# Altium project MEMS_Instrumentation.PrjPCB
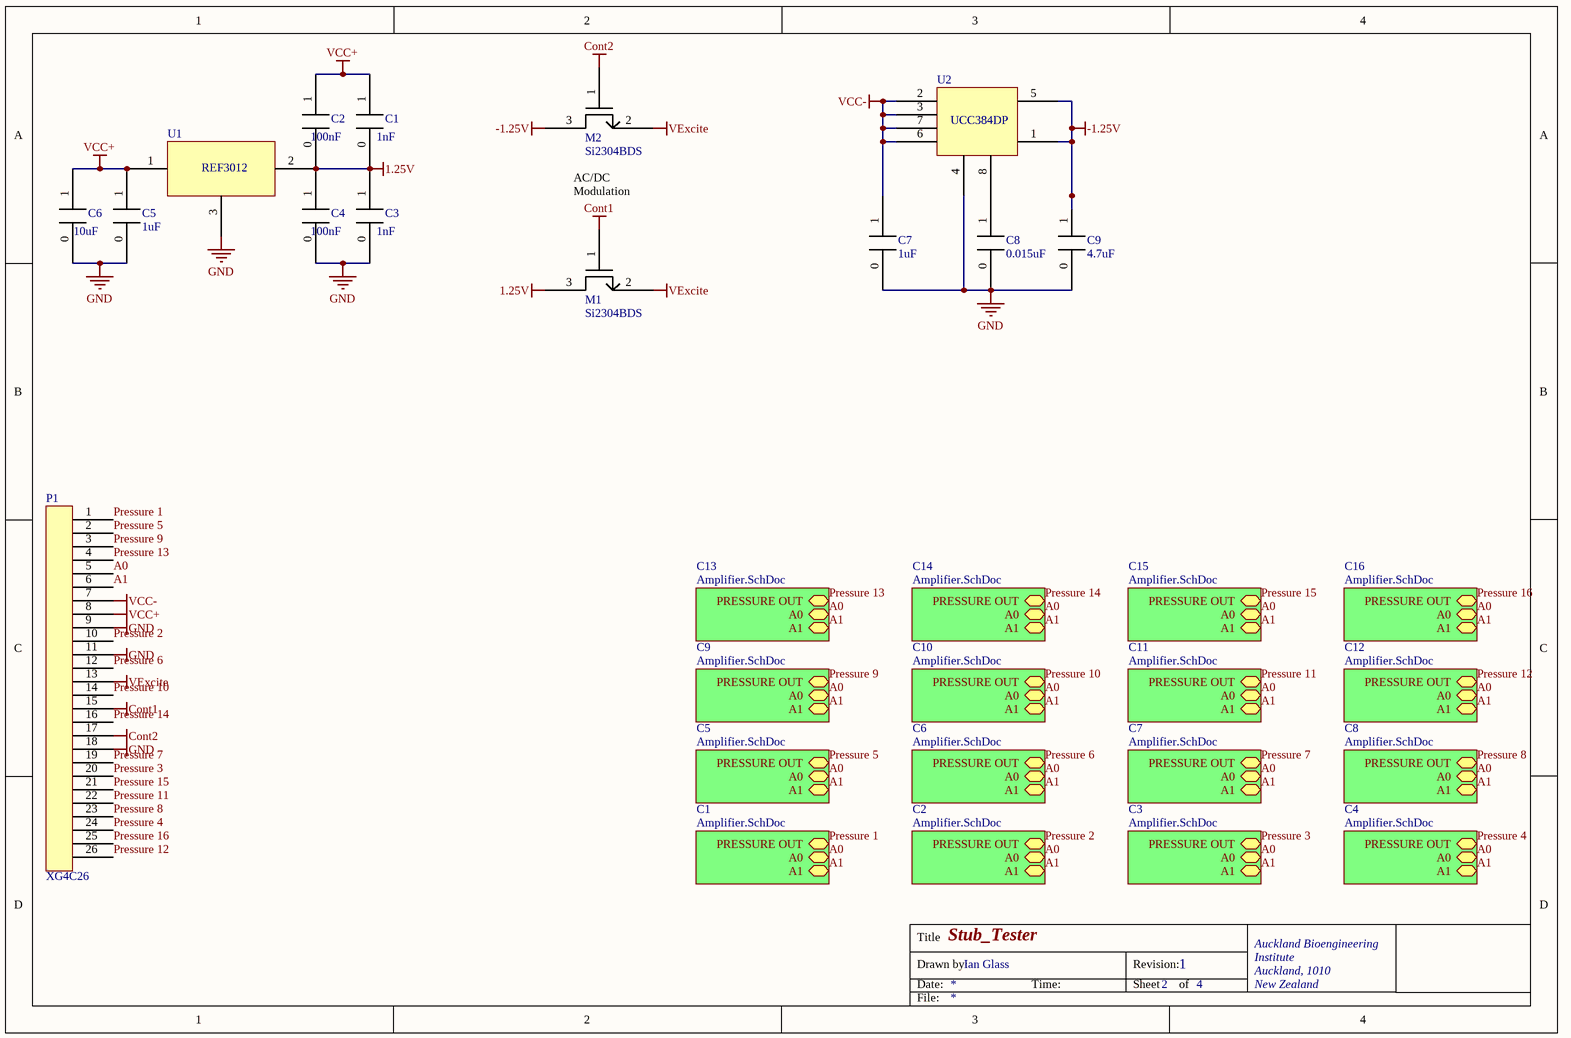
[diagram p0: Stub_Tester.SchDoc]
2 sheets, 110 parts. Net scope: hierarchical (ports join the sheet entries above them; power ports are global).
Board file: MEMS_Instrumentation.PcbDoc
Sheets:
  Stub_Tester.SchDoc
    C1 = Amplifier.SchDoc
    C2 = Amplifier.SchDoc
    C3 = Amplifier.SchDoc
    C4 = Amplifier.SchDoc
    C5 = Amplifier.SchDoc
    C6 = Amplifier.SchDoc
    C7 = Amplifier.SchDoc
    C8 = Amplifier.SchDoc
    C9 = Amplifier.SchDoc
    C10 = Amplifier.SchDoc
    C11 = Amplifier.SchDoc
    C12 = Amplifier.SchDoc
    C13 = Amplifier.SchDoc
    C14 = Amplifier.SchDoc
    C15 = Amplifier.SchDoc
    C16 = Amplifier.SchDoc

## Sheet Stub_Tester.SchDoc: Stub_Tester
size A4; DrawnBy: Ian Glass; Address1: Auckland Bioengineering; Address2: Institute; Address3: Auckland, 1010; Address4: New Zealand; Revision: 1; SheetNumber: 2; SheetTotal: 4

### Parts
C1  1nF  [C0603 1uF]
C2  100nF  [C0603 1uF]
C3  1nF  [C0603 1uF]
C4  100nF  [C0603 1uF]
C5  1uF  [C0603 1uF]
C6  10uF  [C0603 1uF]
C7  1uF  [C0603 1uF]
C8  0.015uF  [C0603 1uF]
C9  4.7uF  [C0603 1uF]
M1  Si2304BDS  [Si2304BDS]
M2  Si2304BDS  [Si2304BDS]
P1  XG4C26  [XG4C26]
U1  REF3012  [REF3012]  (value not drawn)
U2  UCC384DP  [UCC384DP]  (value not drawn)

### Sub-sheets
C1 = Amplifier.SchDoc: PRESSURE OUT, A0, A1
C2 = Amplifier.SchDoc: PRESSURE OUT, A0, A1
C3 = Amplifier.SchDoc: PRESSURE OUT, A0, A1
C4 = Amplifier.SchDoc: PRESSURE OUT, A0, A1
C5 = Amplifier.SchDoc: PRESSURE OUT, A0, A1
C6 = Amplifier.SchDoc: PRESSURE OUT, A0, A1
C7 = Amplifier.SchDoc: PRESSURE OUT, A0, A1
C8 = Amplifier.SchDoc: PRESSURE OUT, A0, A1
C9 = Amplifier.SchDoc: PRESSURE OUT, A0, A1
C10 = Amplifier.SchDoc: PRESSURE OUT, A0, A1
C11 = Amplifier.SchDoc: PRESSURE OUT, A0, A1
C12 = Amplifier.SchDoc: PRESSURE OUT, A0, A1
C13 = Amplifier.SchDoc: PRESSURE OUT, A0, A1
C14 = Amplifier.SchDoc: PRESSURE OUT, A0, A1
C15 = Amplifier.SchDoc: PRESSURE OUT, A0, A1
C16 = Amplifier.SchDoc: PRESSURE OUT, A0, A1

### Nets
1.25V: C1.0 C2.0 C3.1 C4.1 M1.3 U1.2
-1.25V: C9.1 M2.3 U2.1 U2.5
Cont1: M1.1 P1.15
Cont2: M2.1 P1.17
GND: C3.0 C4.0 C5.0 C6.0 C7.0 C8.0 C9.0 P1.9 P1.11 P1.18 U1.3 U2.4
VCC+: C1.1 C2.1 C5.1 C6.1 P1.8 U1.1
VCC-: C7.1 P1.7 U2.2 U2.3 U2.6 U2.7
VExcite: M1.2 M2.2 P1.13
A0: P1.5 ; sheet C1/A0, sheet C2/A0, sheet C3/A0, sheet C4/A0, sheet C5/A0, sheet C6/A0, sheet C7/A0, sheet C8/A0, sheet C9/A0, sheet C10/A0, sheet C11/A0, sheet C12/A0, sheet C13/A0, sheet C14/A0, sheet C15/A0, sheet C16/A0
A1: P1.6 ; sheet C1/A1, sheet C2/A1, sheet C3/A1, sheet C4/A1, sheet C5/A1, sheet C6/A1, sheet C7/A1, sheet C8/A1, sheet C9/A1, sheet C10/A1, sheet C11/A1, sheet C12/A1, sheet C13/A1, sheet C14/A1, sheet C15/A1, sheet C16/A1
Pressure 1: P1.1 ; sheet C1/PRESSURE OUT
Pressure 2: P1.10 ; sheet C2/PRESSURE OUT
Pressure 3: P1.20 ; sheet C3/PRESSURE OUT
Pressure 4: P1.24 ; sheet C4/PRESSURE OUT
Pressure 5: P1.2 ; sheet C5/PRESSURE OUT
Pressure 6: P1.12 ; sheet C6/PRESSURE OUT
Pressure 7: P1.19 ; sheet C7/PRESSURE OUT
Pressure 8: P1.23 ; sheet C8/PRESSURE OUT
Pressure 9: P1.3 ; sheet C9/PRESSURE OUT
Pressure 10: P1.14 ; sheet C10/PRESSURE OUT
Pressure 11: P1.22 ; sheet C11/PRESSURE OUT
Pressure 12: P1.26 ; sheet C12/PRESSURE OUT
Pressure 13: P1.4 ; sheet C13/PRESSURE OUT
Pressure 14: P1.16 ; sheet C14/PRESSURE OUT
Pressure 15: P1.21 ; sheet C15/PRESSURE OUT
Pressure 16: P1.25 ; sheet C16/PRESSURE OUT
NetC8_1: C8.1 U2.8

### Notes on the sheet
- (near M2) AC/DC Modulation
- Title
- Drawn by:
- Date:
- Time:
- Revision:
- Sheet
- of
- File:

### Library data of the parts
C1-C9 = C0603 1uF

## Sheet Amplifier.SchDoc: Amplifier
size A4; DrawnBy: Ian Glass; Address1: Auckland Bioengineering; Address2: Institute; Address3: Auckland, 1010; Address4: New Zealand; Revision: 1; SheetNumber: 4; SheetTotal: 4
Used 16 times, as channels C1, C2, C3, C4, C5, C6, C7, C8, C9, C10, C11, C12, C13, C14, C15, C16. Parts and nets are listed once, with the designators drawn on the sheet.
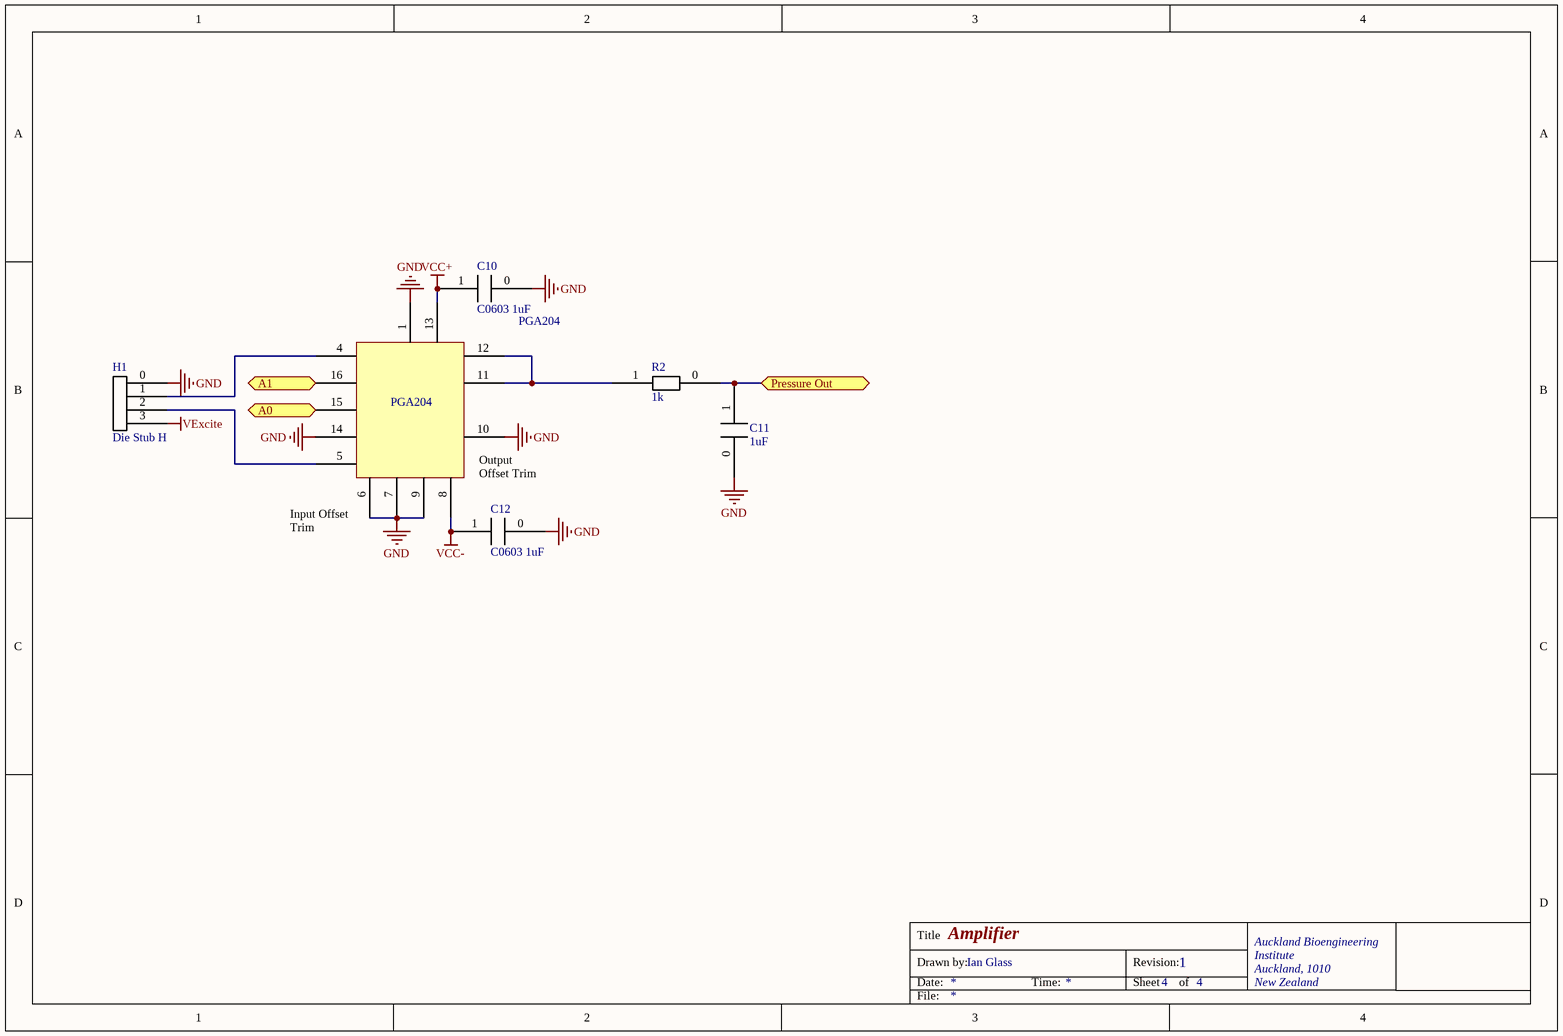
[diagram p1: Amplifier.SchDoc]

### Parts
C10  C0603 1uF  [C0603 1uF]
C11  1uF  [C0603 1uF]
C12  C0603 1uF  [C0603 1uF]
H1  Die Stub H  [Header1x4]
PGA204  PGA204  [PGA204]  (value not drawn)
R2  1k  [RT0603 330k]

### Ports
A0, A1, Pressure Out

### Nets
GND: C10.0 C11.0 C12.0 H1.0 PGA204.1 PGA204.6 PGA204.7 PGA204.9 PGA204.10 PGA204.14
VCC+: C10.1 PGA204.13
VCC-: C12.1 PGA204.8
VExcite: H1.3
A0: PGA204.15 ; port A0
A1: PGA204.16 ; port A1
Pressure Out: C11.1 R2.0 ; port Pressure Out
NetH1_1: H1.1 PGA204.4
NetH1_2: H1.2 PGA204.5
NetPGA204_11: PGA204.11 PGA204.12 R2.1

### Channels
C1: designators end in _C1; ports A0=A0 A1=A1 Pressure Out=Pressure 1
C2: designators end in _C2; ports A0=A0 A1=A1 Pressure Out=Pressure 2
C3: designators end in _C3; ports A0=A0 A1=A1 Pressure Out=Pressure 3
C4: designators end in _C4; ports A0=A0 A1=A1 Pressure Out=Pressure 4
C5: designators end in _C5; ports A0=A0 A1=A1 Pressure Out=Pressure 5
C6: designators end in _C6; ports A0=A0 A1=A1 Pressure Out=Pressure 6
C7: designators end in _C7; ports A0=A0 A1=A1 Pressure Out=Pressure 7
C8: designators end in _C8; ports A0=A0 A1=A1 Pressure Out=Pressure 8
C9: designators end in _C9; ports A0=A0 A1=A1 Pressure Out=Pressure 9
C10: designators end in _C10; ports A0=A0 A1=A1 Pressure Out=Pressure 10
C11: designators end in _C11; ports A0=A0 A1=A1 Pressure Out=Pressure 11
C12: designators end in _C12; ports A0=A0 A1=A1 Pressure Out=Pressure 12
C13: designators end in _C13; ports A0=A0 A1=A1 Pressure Out=Pressure 13
C14: designators end in _C14; ports A0=A0 A1=A1 Pressure Out=Pressure 14
C15: designators end in _C15; ports A0=A0 A1=A1 Pressure Out=Pressure 15
C16: designators end in _C16; ports A0=A0 A1=A1 Pressure Out=Pressure 16

### Notes on the sheet
- (near PGA204) Output Offset Trim
- (near PGA204) Input Offset Trim
- Title
- Drawn by:
- Date:
- Time:
- Revision:
- Sheet
- of
- File:

### Library data of the parts
C11 = C0603 1uF
H1 = Header1x4
R2 = RT0603 330k

## Nets that join several sheets
GND: Stub_Tester (12 pins), C1 (10 pins), C2 (10 pins), C3 (10 pins), C4 (10 pins), C5 (10 pins), C6 (10 pins), C7 (10 pins), C8 (10 pins), C9 (10 pins), C10 (10 pins), C11 (10 pins), C12 (10 pins), C13 (10 pins), C14 (10 pins), C15 (10 pins), C16 (10 pins)
VCC+: Stub_Tester (6 pins), C1 (C10_C1.1 PGA204_C1.13), C2 (C10_C2.1 PGA204_C2.13), C3 (C10_C3.1 PGA204_C3.13), C4 (C10_C4.1 PGA204_C4.13), C5 (C10_C5.1 PGA204_C5.13), C6 (C10_C6.1 PGA204_C6.13), C7 (C10_C7.1 PGA204_C7.13), C8 (C10_C8.1 PGA204_C8.13), C9 (C10_C9.1 PGA204_C9.13), C10 (C10_C10.1 PGA204_C10.13), C11 (C10_C11.1 PGA204_C11.13), C12 (C10_C12.1 PGA204_C12.13), C13 (C10_C13.1 PGA204_C13.13), C14 (C10_C14.1 PGA204_C14.13), C15 (C10_C15.1 PGA204_C15.13), C16 (C10_C16.1 PGA204_C16.13)
VCC-: Stub_Tester (6 pins), C1 (C12_C1.1 PGA204_C1.8), C2 (C12_C2.1 PGA204_C2.8), C3 (C12_C3.1 PGA204_C3.8), C4 (C12_C4.1 PGA204_C4.8), C5 (C12_C5.1 PGA204_C5.8), C6 (C12_C6.1 PGA204_C6.8), C7 (C12_C7.1 PGA204_C7.8), C8 (C12_C8.1 PGA204_C8.8), C9 (C12_C9.1 PGA204_C9.8), C10 (C12_C10.1 PGA204_C10.8), C11 (C12_C11.1 PGA204_C11.8), C12 (C12_C12.1 PGA204_C12.8), C13 (C12_C13.1 PGA204_C13.8), C14 (C12_C14.1 PGA204_C14.8), C15 (C12_C15.1 PGA204_C15.8), C16 (C12_C16.1 PGA204_C16.8)
VExcite: Stub_Tester (M1.2 M2.2 P1.13), C1 (H1_C1.3), C2 (H1_C2.3), C3 (H1_C3.3), C4 (H1_C4.3), C5 (H1_C5.3), C6 (H1_C6.3), C7 (H1_C7.3), C8 (H1_C8.3), C9 (H1_C9.3), C10 (H1_C10.3), C11 (H1_C11.3), C12 (H1_C12.3), C13 (H1_C13.3), C14 (H1_C14.3), C15 (H1_C15.3), C16 (H1_C16.3)
A0: Stub_Tester (P1.5), C1 (PGA204_C1.15), C2 (PGA204_C2.15), C3 (PGA204_C3.15), C4 (PGA204_C4.15), C5 (PGA204_C5.15), C6 (PGA204_C6.15), C7 (PGA204_C7.15), C8 (PGA204_C8.15), C9 (PGA204_C9.15), C10 (PGA204_C10.15), C11 (PGA204_C11.15), C12 (PGA204_C12.15), C13 (PGA204_C13.15), C14 (PGA204_C14.15), C15 (PGA204_C15.15), C16 (PGA204_C16.15)
A1: Stub_Tester (P1.6), C1 (PGA204_C1.16), C2 (PGA204_C2.16), C3 (PGA204_C3.16), C4 (PGA204_C4.16), C5 (PGA204_C5.16), C6 (PGA204_C6.16), C7 (PGA204_C7.16), C8 (PGA204_C8.16), C9 (PGA204_C9.16), C10 (PGA204_C10.16), C11 (PGA204_C11.16), C12 (PGA204_C12.16), C13 (PGA204_C13.16), C14 (PGA204_C14.16), C15 (PGA204_C15.16), C16 (PGA204_C16.16)
Pressure 1: Stub_Tester (P1.1), C1 (C11_C1.1 R2_C1.0)
Pressure 2: Stub_Tester (P1.10), C2 (C11_C2.1 R2_C2.0)
Pressure 3: Stub_Tester (P1.20), C3 (C11_C3.1 R2_C3.0)
Pressure 4: Stub_Tester (P1.24), C4 (C11_C4.1 R2_C4.0)
Pressure 5: Stub_Tester (P1.2), C5 (C11_C5.1 R2_C5.0)
Pressure 6: Stub_Tester (P1.12), C6 (C11_C6.1 R2_C6.0)
Pressure 7: Stub_Tester (P1.19), C7 (C11_C7.1 R2_C7.0)
Pressure 8: Stub_Tester (P1.23), C8 (C11_C8.1 R2_C8.0)
Pressure 9: Stub_Tester (P1.3), C9 (C11_C9.1 R2_C9.0)
Pressure 10: Stub_Tester (P1.14), C10 (C11_C10.1 R2_C10.0)
Pressure 11: Stub_Tester (P1.22), C11 (C11_C11.1 R2_C11.0)
Pressure 12: Stub_Tester (P1.26), C12 (C11_C12.1 R2_C12.0)
Pressure 13: Stub_Tester (P1.4), C13 (C11_C13.1 R2_C13.0)
Pressure 14: Stub_Tester (P1.16), C14 (C11_C14.1 R2_C14.0)
Pressure 15: Stub_Tester (P1.21), C15 (C11_C15.1 R2_C15.0)
Pressure 16: Stub_Tester (P1.25), C16 (C11_C16.1 R2_C16.0)